# Altium schematic sheet Magnetic Sensor.SchDoc
size Tabloid
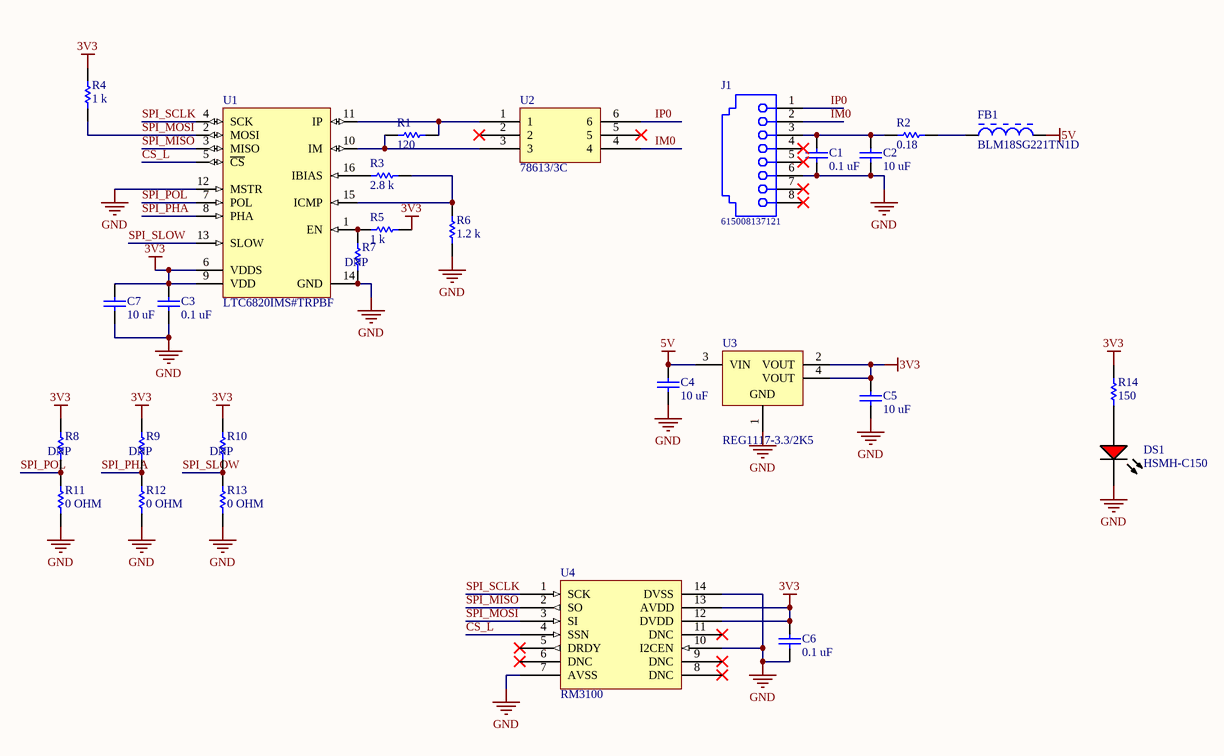
[diagram p0: Magnetic Sensor.SchDoc]

## Parts
C1  0.1 uF  [CAPC1608X87X35NL15T15]
C2  10 uF  [CAPC1608X90X20ML10]
C3  0.1 uF  [CAPC1608X87X35NL15T15]
C4  10 uF  [CAPC1608X90X20ML10]
C5  10 uF  [CAPC1608X90X20ML10]
C6  0.1 uF  [CAPC1608X87X35NL15T15]
C7  10 uF  [CAPC1608X90X20ML10]
DS1  HSMH-C150  [AVAG-HSMX-C150_V]
FB1  BLM18SG221TN1D  [MURA-BLM18SG-B25-CHIP-2_V1]
J1  615008137121  [615008137121]
R1  120  [RESC1609X55X30ML15T15]
R2  0.18  [RESC1608X55X30LL15T15]
R3  2.8 k  [RESC0603(1608)_L]
R4  1 k  [RESC1609X55X30ML10T20]
R5  1 k  [RESC1609X55X30ML10T20]
R6  1.2 k  [RESC1608X55X25ML10T15]
R7  DNP  [RESC1608X55X25ML10T15]
R8  DNP  [RESC1608X55X25ML10T15]
R9  DNP  [RESC1608X55X25ML10T15]
R10  DNP  [RESC1608X55X25ML10T15]
R11  0 OHM  [RESC1608X55X25ML10T15]
R12  0 OHM  [RESC1608X55X25ML10T15]
R13  0 OHM  [RESC1608X55X25ML10T15]
R14  150  [RESC1608X55X30NL15T15]
U1  LTC6820IMS#TRPBF  [LT-MS-16_N]
U2  78613/3C  [DIP6-400]
U3  REG1117-3.3/2K5  [DCY0004A_M]
U4  RM3100  [DIP14-900]

## Nets
3V3: C3.2 C5.2 C6.2 C7.2 R4.2 R5.2 R8.2 R9.2 R10.2 R14.2 U1.6(VDDS) U1.9(VDD) U3.2(VOUT) U3.4(VOUT) U4.12(DVDD) U4.13(AVDD)
5V: C4.2 FB1.2 U3.3(VIN)
GND: C1.1 C2.1 C3.1 C4.1 C5.1 C6.1 C7.1 DS1.2(K) J1.6 R6.1 R7.1 R11.1 R12.1 R13.1 U1.12(MSTR) U1.14(GND) U3.1(GND) U4.7(AVSS) U4.10(I2CEN) U4.14(DVSS)
CS_L: U1.5(~{CS}) U4.4(SSN)
IM0: J1.2 U2.4
IP0: J1.1 U2.6
SPI_MISO: U1.3(MISO) U4.2(SO)
SPI_MOSI: R4.1 U1.2(MOSI) U4.3(SI)
SPI_PHA: R9.1 R12.2 U1.8(PHA)
SPI_POL: R8.1 R11.2 U1.7(POL)
SPI_SCLK: U1.4(SCK) U4.1(SCK)
SPI_SLOW: R10.1 R13.2 U1.13(SLOW)
NetC1_2: C1.2 C2.2 J1.3 R2.1
NetDS1_1: DS1.1(A) R14.1
NetFB1_1: FB1.1 R2.2
NetR1_1: R1.1 U1.10(IM) U2.3
NetR1_2: R1.2 U1.11(IP) U2.1
NetR3_1: R3.1 U1.16(IBIAS)
NetR3_2: R3.2 R6.2 U1.15(ICMP)
NetR5_1: R5.1 R7.2 U1.1(EN)

Not connected (* = marked no-connect by the designer): J1 4* 5* 7* 8*; U2 2* 5*; U4 5(DRDY)* 6(DNC)* 8(DNC)* 9(DNC)* 11(DNC)*

## Library data of the parts
C1 C3 C6 = CMP-2006-03300-1: Part Number: C0603X104K5RACTU; Manufacturer: Kemet
C2 C4 C5 C7 = CMP-2000-04979-1: Chip Capacitor, 10 uF, +/- 10%, 10 V, -55 to 85 degC, 0603 (1608 Metric), RoHS, Tape and Reel; PCN Part Number: MLCCPartNumberChange30/Nov/2012; Manufacturer: TDK; Temperature Coefficient: X5R; Product Training Modules: CSeriesGeneralApplicationsSEAT,CCV,andTVCLDesignToolsGuidetoReplacinganElectrolyticCapacitorwithanMLCC; Online Catalog: CSeries,GeneralPurpose; Voltage - Rated: 10V; Other Names: 445-7486-1; Capacitance: 10µF; Design Resources: 20WNon-IsolatedBuckLEDDriverUsingPLLNK460KG; Kits: 445-9003-KIT-ND-KITCAPCERHICAPMLCCSMD; Height - Seated (Max): -; Family: CeramicCapacitors; Package Description: 2-Pin Surface Mount Device, Body 1.6 x 0.8 mm; Category: Capacitors; Datasheet Version: Mar-15; RoHS Information: RoHSCertificate-MLCC; Thickness (Max): 0.035"(0.90mm); Operating Temperature: -55degC~85degC; Package Reference: 603; Series: C; Applications: GeneralPurpose; Datasheet URL: http://download.siliconexpert.com/pdfs/2015/4/21/15/54/45/779/tdk_/manual/37024850441143360mlcc_commercial_general_en.pdf; Features: -; Lead Style: -; Lead Spacing: -; Ratings: -; Size / Dimension: 0.063"Lx0.031"W(1.60mmx0.80mm); Tolerance: ±10%; Mounting Type: SurfaceMount,MLCC; Standard Package: 1; Package / Case: 0603(1608Metric); Manufacturer URL: http://www.tdk.com/; Packaging: CutTape(CT)
DS1 = CMP-2000-06426-1: LED Uni-Color Red, 65 mW, 25 mA, -40 to 85 degC, 2-Pin SMD, RoHS, Tape and Reel; Manufacturer: Avago; Product Height (mm): 1.1mm; Power Dissipation: 78W; Product Length (mm): 3.2mm; Forward Voltage: 2.6V; Luminous Intensity: 17mcd; DELETED: Compliant; Shape Type: Rectangular; Peak Wavelength: 660nm; Main Category: ChipLED; Dominant Wave Length: 639nm; Rad Hardened: No; Lens Type: ColorlessDiffused; Product Depth (mm): 1.6mm; Reverse Voltage: 5V; Forward Current: 25mA; Chip Material: GaAlAs; Test Current (It): 20mA; Viewing Angle: 170deg; Number of  Elements: 1; Type: Uni-Color; Package Reference: HSMX-C150; Package Description: 2-Pin Surface Mount Device, Body 3.2 x 1.6 mm; Operating Temp Range: -40Cto85C; Mounting: SurfaceMount; Emitting Color: Red; Pin Count: 2; Operating Temperature Classification: Industrial; Datasheet URL: http://media.digikey.com/pdf/Data%20Sheets/Avago%20PDFs/HSMz-Czzz.pdf; Package Type: ChipLed; Mounting Technology: SurfaceMount; High Brightness: No; Lens Dimensions: 2x1.6x0.6mm; Manufacturer URL: http://www.avagotech.com/; Lum Intensity: 17mcd; Datasheet Version: 03/2012; Packaging: TapeandReel
FB1 = CMP-0686-00596-2: Chip Ferrite Bead for Power Lines (Low DC Resistance Type), 220 Ohm, 2500 mA, -55 to 125 degC, 1.6 x 0.8 x 0.65 mm SMD, Tape and Reel; Manufacturer: Murata; Impedance (at 100 MHz): 220 Ohm +/- 25%; DC Resistance: 0.040 Ohm Max.; Rated Current: 2500 mA; ComponentLink2Description: Datasheet; ComponentLink1Description: Manufacturer URL; ComponentLink3Description: Package Specification; DatasheetVersion: 08/2013; Packing: Tape and Reel; PackageReference: BLM18_H650-2; PackageDescription: 2-Pin Chip, Body 1.6 x 0.8 mm; Mounting Technology: Surface Mount; Operating Temperature Range: -55 to 125 degC; ComponentLink1URL: http://www.murata.com/; ComponentLink2URL: http://www.murata.com/products/catalog/pdf/c31e.pdf; ComponentLink3URL: http://www.murata.com/products/catalog/pdf/c31e.pdf; PartNumber: BLM18SG221TN1D
J1 = CMP-1502-01679-1: Modular Jack WR-MJ, Tab Down, Plastic, Horizontal Entry, THT, 8P8C; Manufacturer: Wurth Elektronik; Rated Current: 1.5A; Working Voltage: 120VAC; Contact Resistance: 20mOhm; Port: 1x1; Withstanding Voltage: 1000VAC; Compliance: Leadfree/RoHS; Package Reference: 615008137121; Entrance: Horizontal; Part Number: 615008137121; Manufacturer URL: http://www.we-online.de; Mounting Technology: THT; Operating Temperature: -40to85degC; Publisher: WurthElektronik; Pin Number: 8P8C; Packaging: Tray; Datasheet URL: https://katalog.we-online.com/em/datasheet/615008137121.pdf
R1 = CMP-2100-03629-1: Chip Resistor, 120 Ohm, +/- 1%, 0.1 W, -55 to 155 degC, 0603 (1608 Metric), RoHS, Tape and Reel; Manufacturer: Panasonic; Power Rating: 100mW; Voltage Rating (DC): 75V; Resistance: 120Ohm; Temperature Coefficient: 100ppm/degreesC; Number of Terminations: 2; Military Standard: Not; Tolerance: 1%; Min Operating Temperature: -55degC; Packaging: TapeandReel; Lead Free: LeadFree; Max Operating Temperature: 155degC; Manufacturer URL: http://www.panasonic.com/; Case Code (Imperial): 0603; REACH SVHC: NoSVHC; Width: 0.031inch; Datasheet URL: https://industrial.panasonic.com/cdbs/www-data/pdf/RDA0000/AOA0000C283.pdf; RoHSCompliant: true; Max Power Dissipation: 100mW; Termination: SMD/SMT; Package Reference: 0603; Height: 0.022inch; Depth: 0.8mm; Package Description: 2-Pin Surface Mount Device, Body 1.6 x 0.85 mm; Contact Plating: Tin; Length: 1.6mm; Package URL: http://www.st.com/st-web-ui/static/active/en/resource/technical/document/datasheet/CD00001320.pdf; Radiation Hardening: No; Package Quantity: 1; Number of Pins: 2; Datasheet Version: 42095.0; Voltage Rating: 75V; Composition: ThickFilm; Case/Package: 0603; Mount: SurfaceMount; Case Code (Metric): 1608
R2 = CMP-2000-00865-1: Part Number: ERJ-3RSFR18V; Manufacturer: Panasonic
R3 = CMP-1012-00559-1: 2K8 0.1W 1% 0603 (1608 Metric)  SMD; Case-EIA: 0603; Case-Metric: 1608; Value: 2800.00 Ohm; Tolerance: 1 %; Technology: SMT; Power: 0.1 W
R4 R5 = CMP-2000-02970-1: Manufacturer: Vishay Dale; Part Number: CRCW06031K00FKEAHP
R6 = CMP-2000-04824-1: Part Number: AC0603FR-071K2L; Manufacturer: Yageo
R7-R13 = CMP-2100-03667-1: Chip Resistor, 0 Ohm, +/- 5%, 0.1 W, -55 to 155 degC, 0603 (1608 Metric), RoHS, Tape and Reel; Manufacturer: Yageo; Temperature Coefficient: 200ppm/degreesC; Voltage Rating: 50V; Power Rating: 100mW; Resistance: 0mOhm; Width: 0.8mm; Max Operating Temperature: 155degC; Tolerance: 5%; Package Reference: 0603; Height: 0.45mm; Depth: 0.8mm; Package Description: 2-Pin Surface Mount Device, Body 1.6 x 0.8 mm; Termination: SMD/SMT; Package Quantity: 5000; Case/Package: 0603; Case Code (Imperial): 0603; Radiation Hardening: No; Number of Pins: 2; Length: 1.6mm; Lead Free: LeadFree; Voltage Rating (DC): 50V; Military Standard: Not; Datasheet URL: http://www.yageo.com/NewPortal/yageodocoutput?fileName=/pdf/R-Chip/PYu-RC_Group_51_RoHS_L_5.pdf; Manufacturer URL: http://www.yageo.com/; Packaging: TapeandReel; Case Code (Metric): 1608; Min Operating Temperature: -55degC; Composition: ThickFilm; RoHSCompliant: true; Contact Plating: Tin; Datasheet Version: Rev. 5, 10/2016; REACH SVHC: NoSVHC
R14 = CMP-2000-00256-1: Part Number: ERJ-3EKF1500V; Manufacturer: Panasonic
U1 = CMP-0937-00011-1: IsoSPI Isolated Communication Interface, 2.7 to 5.5 V, -40 to 85 degC, 16-Pin MSOP (MS), Pb-Free, Tape and Reel; Manufacturer: Linear Technology; IO Supply Current: 1 uA Max.; Supply Current, IDLE State: 2 uA; IO Supply Voltage Range: 1.7 to 5.5 V; Receiver Input Resistance: 35 kOhm; VBIAS: 1.9 to 2.1 V; Packing: Tape and Reel; DatasheetVersion: Rev. A; PartNumber: LTC6820IMS#TRPBF; Mounting Technology: Surface Mount; ComponentLink2Description: Datasheet; ComponentLink3Description: Package Specification; ComponentLink1Description: Manufacturer URL; PackageVersion: Rev. A; Temperature Range (degC): -40 to 85; ComponentLink2URL: http://cds.linear.com/docs/en/datasheet/6820fa.pdf; Power Supply: 2.7 to 5.5 V; ComponentLink1URL: http://www.linear.com/; PackageDescription: 16-Pin Micro Small Outline Package, Body 4.039 x 3 mm, Pitch 0.5 mm; ComponentLink3URL: http://cds.linear.com/docs/en/packaging/05081669_A_MS16.pdf; PackageReference: MS-16
U3 = CMP-0395-00546-2: Single Output LDO, 800 mA, Fixed 3.3 V Output, 3.8 to 15 V Input, with Internal Current Limiting, 4-pin SOT-223 (DCY), -40 to 125 degC, Green (RoHS & no Sb/Br); Manufacturer: Texas Instruments; Rating: Catalog; Vin(Min)(V): 3.8; Vout Adj(Min)(V): 3.3; Vin(Max)(V): 15; Iq(Typ)(mA): 4; Vdo(Typ)(mV): 1100; SubFamily: Single Channel LDO; Fixed Output Options(V): 5; Iout(Max)(A): 0.8; ComponentLink2URL: http://www.ti.com/general/docs/lit/getliterature.tsp?genericPartNumber=REG1117-33&fileType=pdf; DatasheetVersion: SBVS001D; ComponentLink1Description: Manufacturer URL; Mounting Technology: Surface Mount; ComponentLink3Description: Package Specification; PackageReference: DCY0004A; Vout Adj(Max)(V): 3.3; PackageDescription: 4-Pin Plastic Small Outline, Body 3.5 x 6.5 mm, Pitch 2.3 mm; ComponentLink3URL: http://www.ti.com/litv/pdf/mpds094a; Code_JEDEC: TO-261; ComponentLink1URL: http://www.ti.com/; PartNumber: REG1117-3.3/2K5; Eco-Plan: Green (RoHS & no Sb/Br); PackageVersion: 4202506/B; ComponentLink2Description: Datasheet